# Altium schematic sheet RFSOC_SAWG_Mezzanine.SchDoc: RFSOC SAWG
size 420 x 297 mm; Author: G.Kasprowicz; CompanyName: WUT ISE; DrawnBy: G.Kasprowicz; Organization: WUT ISE; Address1: PW ISE; Address2: Nowowiejska 15/19 00-665 Warsaw; Address3: gkasprow@gmail.com; Revision: 1; SheetNumber: 1; SheetTotal: 4; ModifiedBy: -; CheckedDate: -; Title2: Mezzanine; DivGrp: WUT ISE; Designer: G.Kasprowicz; ModifiedDate: -; ProjectName: Sensor Box
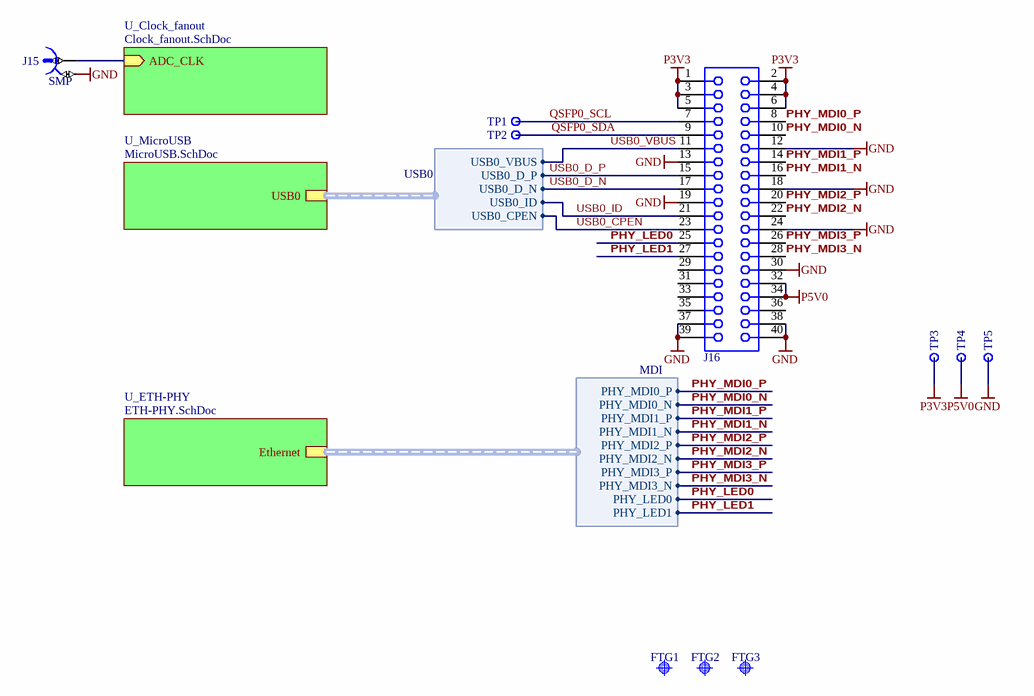
[diagram p0: RFSOC_SAWG_Mezzanine.SchDoc]

## Parts
FTG1  Use only in PCB  [FIDUCIAL_TOP_S100-200]  (value not drawn)
FTG2  Use only in PCB  [FIDUCIAL_TOP_S100-200]  (value not drawn)
FTG3  Use only in PCB  [FIDUCIAL_TOP_S100-200]  (value not drawn)
J15  SMP  [AMPHENOL_302102]
J16  658807713040  [658807713040]  (value not drawn)
TP1  Test Point  [TPS127]  (value not drawn)  (no BOM)
TP2  Test Point  [TPS127]  (value not drawn)  (no BOM)
TP3  Test Point  [TPS127]  (value not drawn)
TP4  Test Point  [TPS127]  (value not drawn)
TP5  Test Point  [TPS127]  (value not drawn)

## Sub-sheets
U_Clock_fanout = Clock_fanout.SchDoc: ADC_CLK (in)
U_ETH-PHY = ETH-PHY.SchDoc: Ethernet (harness MDI)
U_MicroUSB = MicroUSB.SchDoc: USB0 (harness USB0)

## Harnesses
USB0: USB0_VBUS, USB0_D_P, USB0_D_N, USB0_ID, USB0_CPEN
MDI: PHY_MDI0_N, PHY_MDI1_P, PHY_MDI1_N, PHY_MDI2_P, PHY_MDI2_N, PHY_MDI3_P, PHY_MDI3_N, PHY_LED0, PHY_LED1, PHY_MDI0_P

## Nets
GND: J15.2 J16.12 J16.13 J16.18 J16.19 J16.24 J16.30 J16.37 J16.38 J16.39 J16.40 TP5.1
P3V3: J16.1 J16.2 J16.3 J16.4 J16.5 J16.6 TP3.1
P5V0: J16.32 J16.34 TP4.1
PHY_LED0: J16.25 ; sheet U_ETH-PHY/Ethernet.PHY_LED0
PHY_LED1: J16.27 ; sheet U_ETH-PHY/Ethernet.PHY_LED1
PHY_MDI0_N: J16.10 ; sheet U_ETH-PHY/Ethernet.PHY_MDI0_N
PHY_MDI0_P: J16.8 ; sheet U_ETH-PHY/Ethernet.PHY_MDI0_P
PHY_MDI1_N: J16.16 ; sheet U_ETH-PHY/Ethernet.PHY_MDI1_N
PHY_MDI1_P: J16.14 ; sheet U_ETH-PHY/Ethernet.PHY_MDI1_P
PHY_MDI2_N: J16.22 ; sheet U_ETH-PHY/Ethernet.PHY_MDI2_N
PHY_MDI2_P: J16.20 ; sheet U_ETH-PHY/Ethernet.PHY_MDI2_P
PHY_MDI3_N: J16.28 ; sheet U_ETH-PHY/Ethernet.PHY_MDI3_N
PHY_MDI3_P: J16.26 ; sheet U_ETH-PHY/Ethernet.PHY_MDI3_P
QSFP0_SCL: J16.7 TP1.1
QSFP0_SDA: J16.9 TP2.1
USB0_CPEN: J16.23 ; sheet U_MicroUSB/USB0.USB0_CPEN
USB0_D_N: J16.17 ; sheet U_MicroUSB/USB0.USB0_D_N
USB0_D_P: J16.15 ; sheet U_MicroUSB/USB0.USB0_D_P
USB0_ID: J16.21 ; sheet U_MicroUSB/USB0.USB0_ID
USB0_VBUS: J16.11 ; sheet U_MicroUSB/USB0.USB0_VBUS
NetJ15_1: J15.1 ; sheet U_Clock_fanout/ADC_CLK

Not connected (* = marked no-connect by the designer): J16 29 31 33 35 36

## Notes on the sheet
- Project/Equipment
- Document
- Designer
- Drawn by
- Check.by
- Copyright WUT ISE 2020.
  This documentation describes Open Hardware and is licensed under the CERN OHL v.1.2. You may redistribute and modify this documentation under the terms of the CERN OHL v.1.2. (http://ohwr.org/CERNOHL). This documentation is distributed WITHOUT ANY EXPRESS OR IMPLIED WARRANTY, INCLUDING OF MERCHANTABILITY, SATISFACTORY QUALITY AND FITNESS FOR A PARTICULAR PURPOSE. Please see the CERN OHL v.1.2 for applicable conditions.
- Contact
- File
- Last Mod.
- Print Date
- Sheet
- Size
- A3
- of
- Rev

## Library data of the parts
FTG1-FTG3 = FIDUCIAL_TARGET_S100-200: Fiducial Target; Part Description: Square Fiducial Target, Top Layer, 1.0mm, Top Solder 2.0mm, Keepout =2.0mm; Mounted: No; Part Number: FIDUCIAL_TARGET_S100-200; Component Kind: Standard (No BOM); Component Type: Standard (No BOM); Pin Count: 1; Family: Fiducial; Socket: No; SMD: Yes; Sense: No; Status: None; ComponentHeight: 0mm; HelpURL: Undefined; Author: CERN DEM JLC; CreateDate: 09.02.2010; LatestRevisionDate: 04.04.2012; PackageDescription: Square Fiducial Target, Top Layer, 1.0mm, Top Solder 2.0mm, Keepout =2.0mm
J15 = AMPHENOL_302102: Part Description: 50 Ohm RF Connector, SMP End Launch Jack for 1.6mm PCB,  Flat Tab Contact; Manufacturer Part Number: 302102; PressFit: No; Part Number: AMPHENOL_302102; Component Kind: Standard; Component Type: Standard; Pin Count: 2; Family: SMP; Mounted: Yes; Socket: No; SMD: No; Sense: No; Status: None; Manufacturer: AMPHENOL; ComponentHeight: 5.09mm; HelpURL: \\cern.ch\dfs\Applications\Altium\Datasheets\AMPHENOL_302102.pdf; Author: CERN DEM MR; CreateDate: 28.11.2017; LatestRevisionDate: 19.12.2017
J16 = 658807713040: WR-BTB Board to Board Connector, Female Receptacle, pitch 0.8mm, height 7.75mm, 40p; Manufacturer: Wurth Elektronik; Compliance: Lead free / RoHS; Contact Resistance: 50mΩ; Insulation Resistance: 100MΩ; Rated Current: 0.5A; Working Voltage: 50VAC; Withstanding Voltage: 500VAC; ComponentLink1Description: Website Link; ComponentLink1URL: https://www.we-online.com/redexpert/article/658807713040?ad; ComponentLink2Description: Datasheet Link; ComponentLink2URL: https://www.we-online.com/redexpert/spec/658807713040?ad; Manufacturer Part Number: 658807713040; Category: Board-to-Board Connectors; Match Code: WR-BTB; Mount: Surface Mount; Operating Temperature Max: 85°C; Operating Temperature Min: -55°C; Packaging: Tape and Reel; Height: 7.75mm; Gender: Female Receptacle; Number of Pins: 40; Orientation: Vertical; Pitch: 0.8mm
TP1-TP5 = SMD_PAD_1.27X1.27MM: Part Description: 1.27mm x 1.27mm PCB Copper Area (SMD Test Point); Mounted: No; Part Number: SMD_PAD_1.27X1.27MM; Component Type: Standard (No BOM); Pin Count: 1; Family: Test Point; Socket: No; SMD: No; Sense: No; Status: None; ComponentHeight: 0mm; HelpURL: Undefined; Author: CERN DEM JLC; CreateDate: 12.01.2008; LatestRevisionDate: 12.01.2008; PackageDescription: 1.27mm x 1.27mm PCB Copper Area (SMD Test Point)
  TP3-TP5: Component Kind: Standard (No BOM)